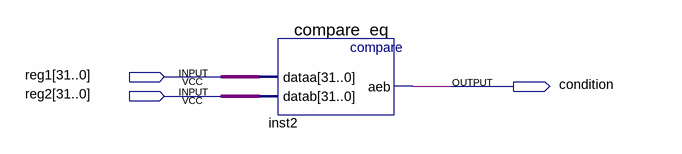
[diagram p0: schematic sheet]
// Quartus schematic beq.bdf as structural Verilog: 1 symbols, 3 pins
module beq (
  input  [31:0] reg1,
  input  [31:0] reg2,
  output condition
);

  compare_eq inst2 (.dataa(reg1), .datab(reg2), .aeb(condition));
endmodule
